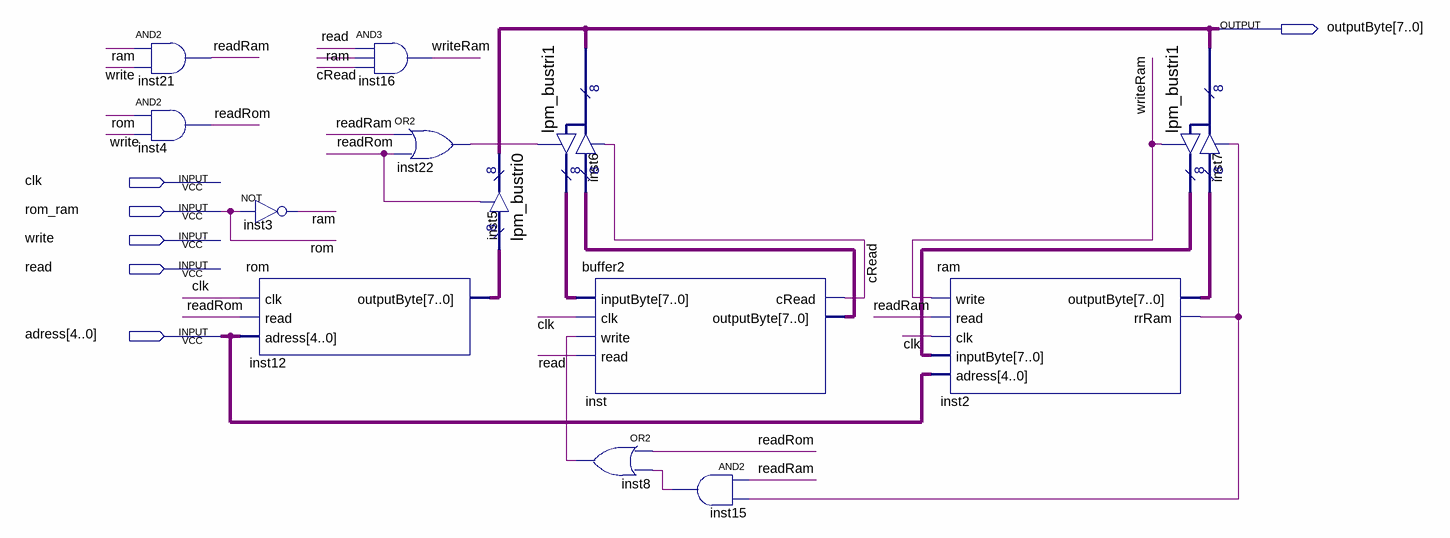
[diagram p0: schematic sheet]
// Quartus schematic Main.bdf as structural Verilog: 13 symbols, 6 pins
module Main (
  input  clk,
  input  rom_ram,
  input  write,
  input  read,
  input  [4:0] adress,
  output [7:0] outputByte
);

  wire cRead, inst2_rrram, inst8_out, inst15_out, inst22_out, ram, readRam, readRom, writeRam;
  wire [7:0] inst2_outputbyte, inst6_result, inst7_result, inst12_outputbyte, inst_outputbyte;

  and inst21 (readRam, ram, write);
  and inst4 (readRom, rom_ram, write);
  not inst3 (ram, rom_ram);
  rom inst12 (.clk(clk), .read(readRom), .adress(adress), .outputByte(inst12_outputbyte));
  and inst16 (writeRam, read, ram, cRead);
  or inst22 (inst22_out, readRam, readRom);
  lpm_bustri0 inst5 (.enabledt(readRom), .data(inst12_outputbyte), .tridata(outputByte));
  lpm_bustri1 inst6 (
    .enabledt(cRead), .data(inst_outputbyte), .enabletr(inst22_out), .result(inst6_result),
    .tridata(outputByte));
  buffer2 inst (
    .inputByte(inst6_result), .clk(clk), .write(inst8_out), .read(read), .cRead(cRead),
    .outputByte(inst_outputbyte));
  or inst8 (inst8_out, readRom, inst15_out);
  and inst15 (inst15_out, readRam, inst2_rrram);
  ram inst2 (
    .write(writeRam), .read(readRam), .clk(clk), .inputByte(inst7_result), .adress(adress),
    .outputByte(inst2_outputbyte), .rrRam(inst2_rrram));
  lpm_bustri1 inst7 (
    .enabledt(inst2_rrram), .data(inst2_outputbyte), .enabletr(writeRam), .result(inst7_result),
    .tridata(outputByte));

  // Other names for the same wires on the sheet: rom = rom_ram
endmodule
